# EAGLE schematic GPS adapter (EAGLE 6.5.0)
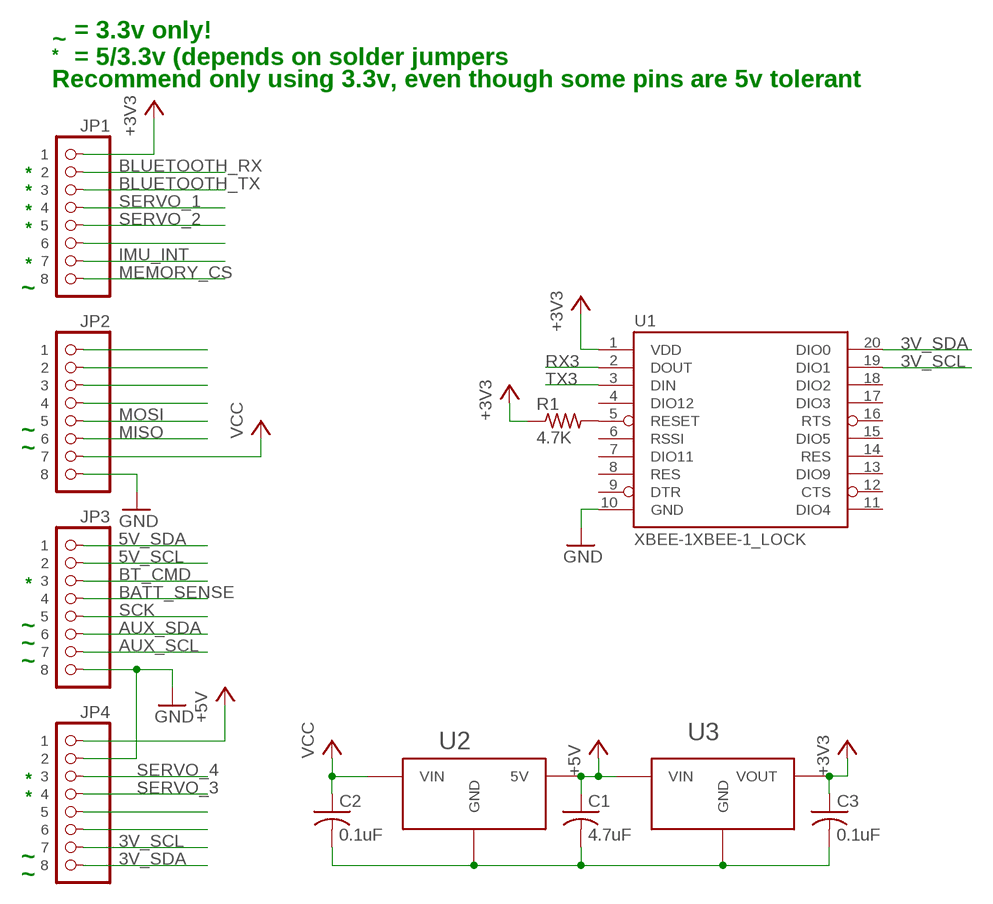
[diagram p0: schematic, sheet 1]

## Parts
C1  4.7uF  C-USC0603  [C0603]
C2  0.1uF  C-USC0603  [C0603]
C3  0.1uF  C-USC0603  [C0603]
JP1  8-PIN_HEADER  [8-PIN_RECEPTACLE_LOCK_NO-SS]
JP2  8-PIN_HEADER  [8-PIN_RECEPTACLE_LOCK_NO-SS]
JP3  8-PIN_HEADER  [8-PIN_RECEPTACLE_LOCK_NO-SS]
JP4  8-PIN_HEADER  [8-PIN_RECEPTACLE_LOCK_NO-SS]
R1  4.7K  R-US_R0603  [R0603]
U1  XBEE-1XBEE-1_LOCK  [XBEE-1_LOCK]
U2  LM2931  [TO263]
U3  AP7313SOT23R  [SOT23]

## Nets
3V_SCL: JP4.P$7 U1.19(DIO1)
3V_SDA: JP4.P$8 U1.20(DIO0)
5V_SCL: JP3.P$2
5V_SDA: JP3.P$1
+3V3: C3.1 JP1.P$1 R1.1 U1.1(VDD) U3.P$2(VOUT)
+5V: C1.1 JP4.P$1 U2.P$3(5V) U3.P$3(VIN)
AUX_SCL: JP3.P$7
AUX_SDA: JP3.P$6
BATT_SENSE: JP3.P$4
BLUETOOTH_RX: JP1.P$2
BLUETOOTH_TX: JP1.P$3
BT_CMD: JP3.P$3
GND: JP2.P$8 JP3.P$8 JP4.P$2 U1.10(GND)
IMU_INT: JP1.P$7
MEMORY_CS: JP1.P$8
MISO: JP2.P$6
MOSI: JP2.P$5
N$2: R1.2 U1.5(RESET)
N$3: C1.2 C2.2 C3.2 U2.P$1(GND) U3.P$1(GND)
N$4: JP2.P$4
N$5: JP2.P$3
N$6: JP2.P$2
N$7: JP2.P$1
N$10: JP1.P$6
N$26: JP4.P$5
N$27: JP4.P$6
RX3: U1.2(DOUT)
SCK: JP3.P$5
SERVO_1: JP1.P$4
SERVO_2: JP1.P$5
SERVO_3: JP4.P$4
SERVO_4: JP4.P$3
TX3: U1.3(DIN)
VCC: C2.1 JP2.P$7 U2.P$2(VIN)
Unconnected: U1.4(DIO12) U1.6(RSSI) U1.7(DIO11) U1.8(RES) U1.9(DTR) U1.11(DIO4) U1.12(CTS) U1.13(DIO9) U1.14(RES) U1.15(DIO5) U1.16(RTS) U1.17(DIO3) U1.18(DIO2)

## Notes on the sheet
- = 3.3v only!
- ~
- * | = 5/3.3v (depends on solder jumpers
- Recommend only using 3.3v, even though some pins are 5v tolerant
- *
- *
- *
- *
- *
- ~
- ~
- ~
- *
- ~
- ~
- ~
- *
- *
- ~
- ~

## Library data of the parts
C1-C3 = resistor:C-US: CAPACITOR, American symbol
JP1-JP4 = My Parts:8-PIN_HEADER
R1 = resistor:R-US_: RESISTOR, American symbol
U1 = SparkFun-RF:XBEE-1: Xbee module footprints SMT header is CONN-09042.
U2 = on-semiconductor:LM2931
U3 = My Parts:AP7313: 3.3v LDO Voltage Regulator